# Altium schematic sheet SENSOR.SchDoc
size 420 x 297 mm; SheetNumber: 4; SheetTotal: 4
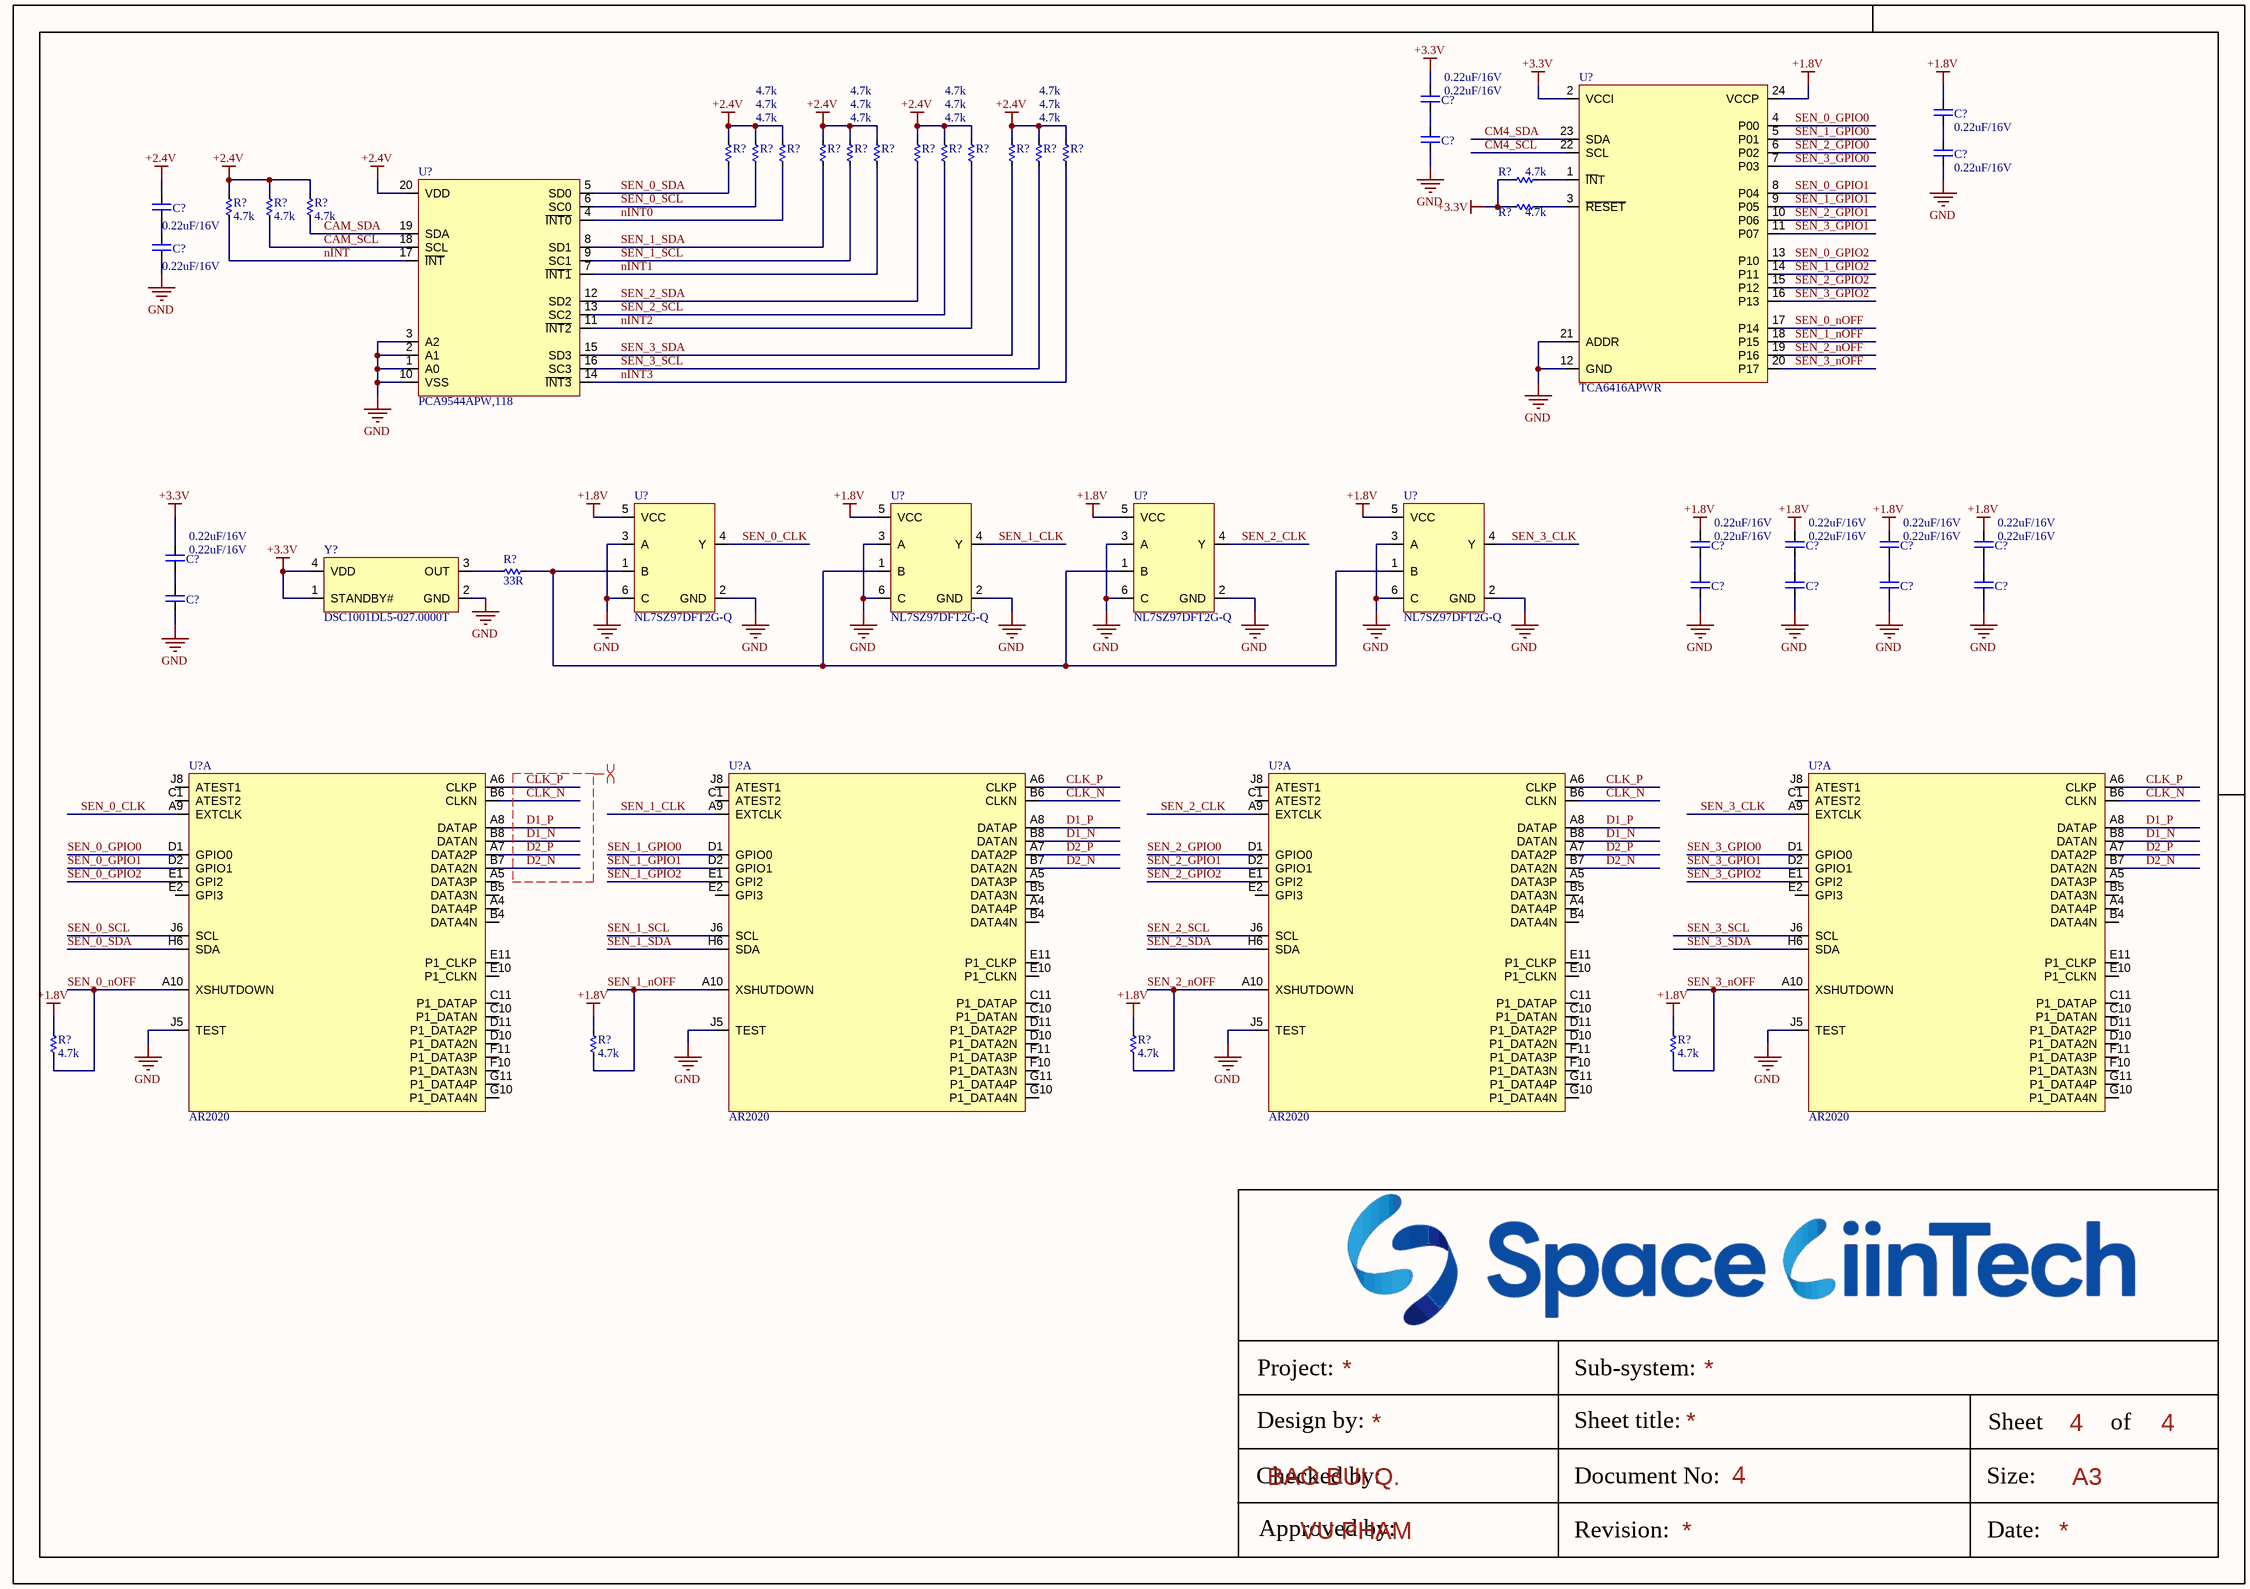
[diagram p0: SENSOR.SchDoc]

## Parts
(Parts that share a designator on the sheet are numbered #1, #2 ... from top to bottom, then left to right.)
C?#1  0.22uF/16V
C?#2  0.22uF/16V
C?#3  0.22uF/16V
C?#4  0.22uF/16V
C?#5  0.22uF/16V
C?#6  0.22uF/16V
C?#7  0.22uF/16V
C?#8  0.22uF/16V
C?#9  0.22uF/16V
C?#10  0.22uF/16V
C?#11  0.22uF/16V
C?#12  0.22uF/16V
C?#13  0.22uF/16V
C?#14  0.22uF/16V
C?#15  0.22uF/16V
C?#16  0.22uF/16V
R?#1  4.7k
R?#2  4.7k
R?#3  4.7k
R?#4  4.7k
R?#5  4.7k
R?#6  4.7k
R?#7  4.7k
R?#8  4.7k
R?#9  4.7k
R?#10  4.7k
R?#11  4.7k
R?#12  4.7k
R?#13  4.7k
R?#14  4.7k
R?#15  4.7k
R?#16  4.7k
R?#17  4.7k
R?#18  33R
R?#19  4.7k
R?#20  4.7k
R?#21  4.7k
R?#22  4.7k
U?#1  TCA6416APWR
U?#2  PCA9544APW,118
U?#3  NL7SZ97DFT2G-Q
U?#4  NL7SZ97DFT2G-Q
U?#5  NL7SZ97DFT2G-Q
U?#6  NL7SZ97DFT2G-Q
U?#7  AR2020  (part A of 2)
U?#8  AR2020  (part A of 2)
U?#9  AR2020  (part A of 2)
U?#10  AR2020  (part A of 2)
Y?  DSC1001DL5-027.0000T

## Nets
+1.8V: C?#2.2 C?#7.2 C?#8.2 C?#9.2 C?#10.2 R?#19.2 R?#20.2 R?#21.2 R?#22.2 U?#1.24(VCCP) U?#3.5(VCC) U?#4.5(VCC) U?#5.5(VCC) U?#6.5(VCC)
+2.4V: C?#5.2 R?#1.1 R?#2.1 R?#3.1 R?#4.1 R?#5.1 R?#6.1 R?#7.1 R?#8.1 R?#9.1 R?#10.1 R?#11.1 R?#12.1 R?#14.1 R?#15.1 R?#16.1 U?#2.20(VDD)
+3.3V: C?#1.2 C?#11.2 R?#13.1 R?#17.1 U?#1.2(VCCI) Y?.1(STANDBY#) Y?.4(VDD)
GND: C?#3.1 C?#4.1 C?#6.1 C?#12.1 C?#13.1 C?#14.1 C?#15.1 C?#16.1 U?#1.12(GND) U?#1.21(ADDR) U?#2.1(A0) U?#2.2(A1) U?#2.3(A2) U?#2.10(VSS) U?#3.2(GND) U?#3.3(A) U?#3.6(C) U?#4.2(GND) U?#4.3(A) U?#4.6(C) U?#5.2(GND) U?#5.3(A) U?#5.6(C) U?#6.2(GND) U?#6.3(A) U?#6.6(C) U?#7.J5(TEST) U?#8.J5(TEST) U?#9.J5(TEST) U?#10.J5(TEST) Y?.2(GND)
CAM_SCL: R?#15.2 U?#2.18(SCL)
CAM_SDA: R?#16.2 U?#2.19(SDA)
CLK_N: U?#7.B6(CLKN) U?#8.B6(CLKN) U?#9.B6(CLKN) U?#10.B6(CLKN)
CLK_P: U?#7.A6(CLKP) U?#8.A6(CLKP) U?#9.A6(CLKP) U?#10.A6(CLKP)
CM4_SCL: U?#1.22(SCL)
CM4_SDA: U?#1.23(SDA)
D1_N: U?#7.B8(DATAN) U?#8.B8(DATAN) U?#9.B8(DATAN) U?#10.B8(DATAN)
D1_P: U?#7.A8(DATAP) U?#8.A8(DATAP) U?#9.A8(DATAP) U?#10.A8(DATAP)
D2_N: U?#7.B7(DATA2N) U?#8.B7(DATA2N) U?#9.B7(DATA2N) U?#10.B7(DATA2N)
D2_P: U?#7.A7(DATA2P) U?#8.A7(DATA2P) U?#9.A7(DATA2P) U?#10.A7(DATA2P)
nINT: R?#14.2 U?#2.17(~{INT})
nINT0: R?#3.2 U?#2.4(~{INT0})
nINT1: R?#6.2 U?#2.7(~{INT1})
nINT2: R?#9.2 U?#2.11(~{INT2})
nINT3: R?#12.2 U?#2.14(~{INT3})
SEN_0_CLK: U?#3.4(Y) U?#7.A9(EXTCLK)
SEN_0_GPIO0: U?#1.4(P00) U?#7.D1(GPIO0)
SEN_0_GPIO1: U?#1.8(P04) U?#7.D2(GPIO1)
SEN_0_GPIO2: U?#1.13(P10) U?#7.E1(GPI2)
SEN_0_nOFF: R?#19.1 U?#1.17(P14) U?#7.A10(XSHUTDOWN)
SEN_0_SCL: R?#2.2 U?#2.6(SC0) U?#7.J6(SCL)
SEN_0_SDA: R?#1.2 U?#2.5(SD0) U?#7.H6(SDA)
SEN_1_CLK: U?#4.4(Y) U?#8.A9(EXTCLK)
SEN_1_GPIO0: U?#1.5(P01) U?#8.D1(GPIO0)
SEN_1_GPIO1: U?#1.9(P05) U?#8.D2(GPIO1)
SEN_1_GPIO2: U?#1.14(P11) U?#8.E1(GPI2)
SEN_1_nOFF: R?#20.1 U?#1.18(P15) U?#8.A10(XSHUTDOWN)
SEN_1_SCL: R?#5.2 U?#2.9(SC1) U?#8.J6(SCL)
SEN_1_SDA: R?#4.2 U?#2.8(SD1) U?#8.H6(SDA)
SEN_2_CLK: U?#5.4(Y) U?#9.A9(EXTCLK)
SEN_2_GPIO0: U?#1.6(P02) U?#9.D1(GPIO0)
SEN_2_GPIO1: U?#1.10(P06) U?#9.D2(GPIO1)
SEN_2_GPIO2: U?#1.15(P12) U?#9.E1(GPI2)
SEN_2_nOFF: R?#21.1 U?#1.19(P16) U?#9.A10(XSHUTDOWN)
SEN_2_SCL: R?#8.2 U?#2.13(SC2) U?#9.J6(SCL)
SEN_2_SDA: R?#7.2 U?#2.12(SD2) U?#9.H6(SDA)
SEN_3_CLK: U?#6.4(Y) U?#10.A9(EXTCLK)
SEN_3_GPIO0: U?#1.7(P03) U?#10.D1(GPIO0)
SEN_3_GPIO1: U?#1.11(P07) U?#10.D2(GPIO1)
SEN_3_GPIO2: U?#1.16(P13) U?#10.E1(GPI2)
SEN_3_nOFF: R?#22.1 U?#1.20(P17) U?#10.A10(XSHUTDOWN)
SEN_3_SCL: R?#11.2 U?#2.16(SC3) U?#10.J6(SCL)
SEN_3_SDA: R?#10.2 U?#2.15(SD3) U?#10.H6(SDA)
NetC?#1_1: C?#1.1 C?#3.2
NetC?#2_1: C?#2.1 C?#4.2
NetC?#5_1: C?#5.1 C?#6.2
NetC?#7_1: C?#7.1 C?#12.2
NetC?#8_1: C?#8.1 C?#13.2
NetC?#9_1: C?#9.1 C?#14.2
NetC?#10_1: C?#10.1 C?#15.2
NetC?#11_1: C?#11.1 C?#16.2
NetR?#13_2: R?#13.2 U?#1.1(~{IN}T)
NetR?#17_2: R?#17.2 U?#1.3(~{RESET})
NetR?#18_1: R?#18.1 U?#3.1(B) U?#4.1(B) U?#5.1(B) U?#6.1(B)
NetR?#18_2: R?#18.2 Y?.3(OUT)

Not connected (* = marked no-connect by the designer): U?#7 A4(DATA4P) A5(DATA3P) B4(DATA4N) B5(DATA3N) C1(ATEST2) C10(P1_DATAN) C11(P1_DATAP) D10(P1_DATA2N) D11(P1_DATA2P) E2(GPI3) E10(P1_CLKN) E11(P1_CLKP) F10(P1_DATA3N) F11(P1_DATA3P) G10(P1_DATA4N) G11(P1_DATA4P) J8(ATEST1); U?#8 A4(DATA4P) A5(DATA3P) B4(DATA4N) B5(DATA3N) C1(ATEST2) C10(P1_DATAN) C11(P1_DATAP) D10(P1_DATA2N) D11(P1_DATA2P) E2(GPI3) E10(P1_CLKN) E11(P1_CLKP) F10(P1_DATA3N) F11(P1_DATA3P) G10(P1_DATA4N) G11(P1_DATA4P) J8(ATEST1); U?#9 A4(DATA4P) A5(DATA3P) B4(DATA4N) B5(DATA3N) C1(ATEST2) C10(P1_DATAN) C11(P1_DATAP) D10(P1_DATA2N) D11(P1_DATA2P) E2(GPI3) E10(P1_CLKN) E11(P1_CLKP) F10(P1_DATA3N) F11(P1_DATA3P) G10(P1_DATA4N) G11(P1_DATA4P) J8(ATEST1); U?#10 A4(DATA4P) A5(DATA3P) B4(DATA4N) B5(DATA3N) C1(ATEST2) C10(P1_DATAN) C11(P1_DATAP) D10(P1_DATA2N) D11(P1_DATA2P) E2(GPI3) E10(P1_CLKN) E11(P1_CLKP) F10(P1_DATA3N) F11(P1_DATA3P) G10(P1_DATA4N) G11(P1_DATA4P) J8(ATEST1)

## Layout directives
differential pair; net class DIFF100: CLK_N, CLK_P, D1_N, D1_P, D2_N, D2_P

## Notes on the sheet
- Project:
- Sub-system:
- Design by:
- BAO BUI Q.
- Sheet title:
- Sheet
- A3
- of
- Checked by:
- Approved by:
- VU PHAM
- Revision:
- Document No:
- Size:
- Date:

## Library data of the parts
C?#1-C?#16 = CAP_SMD: CAP_Chip; Value: 33pF
R?#1-R?#22 = RES-SMD: RES-Chip; Manufacturer: Generic Components; Class: Passive; Published: 08/06/2000; Publisher: Altium Hobart Technology Centre
U?#1 = IC_I2Cto16IO_TCA6416APWR
U?#2 = IC_I2CSW1to4_PCA9544APW,118
U?#3-U?#6 = IC_FLEXLOGIC_NL7SZ97DFT2G-Q
Y? = Y_OSC27MHz_DSC1001DL5-027.0000T